# Altium schematic sheet Enregistreur et Speaker Audio.SchDoc
size Letter; Organization: Cegep Limoilou; Address1: 1300, 8e Avenue; Address2: Québec, QC; Address3: Canada; Address4: G1J 5L5; Revision: Enseignants; SheetNumber: 4; SheetTotal: 9; Conception: Ilyes Gharmoul; Titre: Enregistreur et Speaker; Modification: Ilyes G
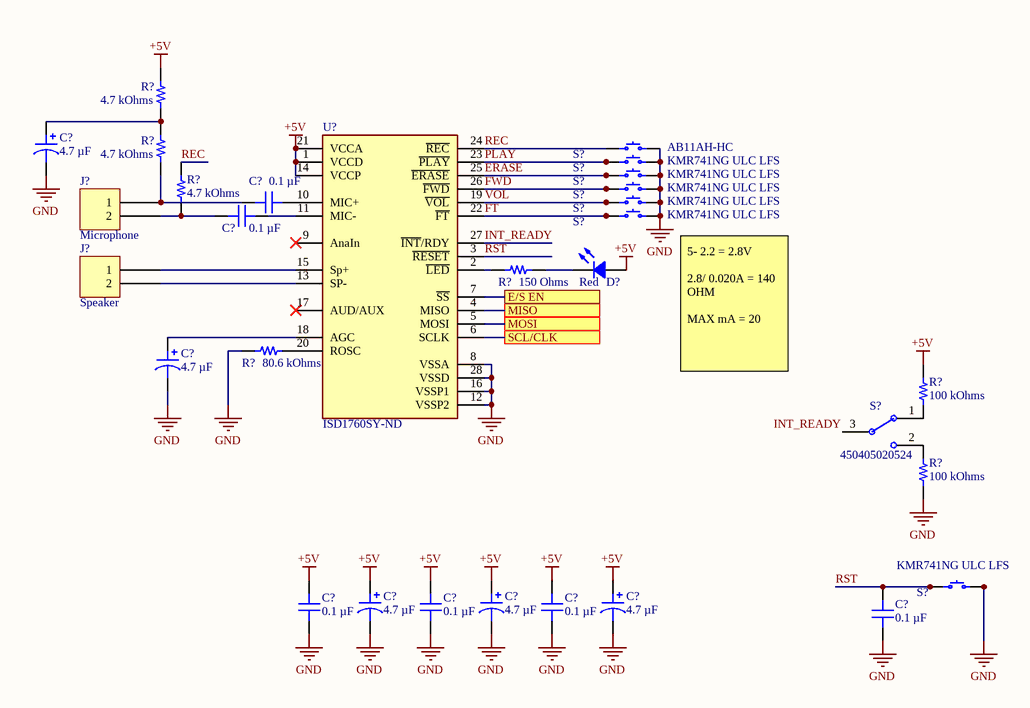
[diagram p0: Enregistreur et Speaker Audio.SchDoc]

## Parts
(Parts that share a designator on the sheet are numbered #1, #2 ... from top to bottom, then left to right.)
C?#1  4.7 µF  [CAP ALSMD 4.3MM H5.4MM]
C?#2  0.1 µF  [CAP 0603_1608]
C?#3  0.1 µF  [CAP 0603_1608]
C?#4  4.7 µF  [CAP ALSMD 4.3MM H5.4MM]
C?#5  0.1 µF  [CAP 0603_1608]
C?#6  4.7 µF  [CAP ALSMD 4.3MM H5.4MM]
C?#7  0.1 µF  [CAP 0603_1608]
C?#8  4.7 µF  [CAP ALSMD 4.3MM H5.4MM]
C?#9  0.1 µF  [CAP 0603_1608]
C?#10  4.7 µF  [CAP ALSMD 4.3MM H5.4MM]
C?#11  0.1 µF  [CAP 0603_1608]
D?  Red  [LED 0603_1608 RED]
J?#1  Microphone  [TE 282834-2]
J?#2  Speaker  [TE 282834-2]
R?#1  4.7 kOhms  [RES 0603_1608]
R?#2  4.7 kOhms  [RES 0603_1608]
R?#3  4.7 kOhms  [RES 0603_1608]
R?#4  150 Ohms  [RES 0603_1608]
R?#5  80.6 kOhms  [RES 0603_1608]
R?#6  100 kOhms  [RES 0603_1608]
R?#7  100 kOhms  [RES 0603_1608]
S?#1  AB11AH-HC  [NKK AB11AH-HC]
S?#2  KMR741NG ULC LFS  [C&K KMR7]
S?#3  KMR741NG ULC LFS  [C&K KMR7]
S?#4  KMR741NG ULC LFS  [C&K KMR7]
S?#5  KMR741NG ULC LFS  [C&K KMR7]
S?#6  KMR741NG ULC LFS  [C&K KMR7]
S?#7  450405020524  [WURTH WS-SLSU 450405020524]
S?#8  KMR741NG ULC LFS  [C&K KMR7]
U?  Supplier Part Number 1: ISD1760SY-ND  [ISD1760SY]  (hidden comment: ISD1760SY)

## Ports
E/S EN, MISO, MOSI, SCL/CLK

## Nets
+5V: C?#5.2 C?#6.1 C?#7.2 C?#8.1 C?#9.2 C?#10.1 D?.1 R?#1.2 R?#6.2 U?.1(VCCD) U?.14(VCCP) U?.21(VCCA)
GND: C?#1.2 C?#4.2 C?#5.1 C?#6.2 C?#7.1 C?#8.2 C?#9.1 C?#10.2 C?#11.1 R?#5.1 R?#7.1 S?#1.2 S?#2.3 S?#2.4 S?#3.3 S?#3.4 S?#4.3 S?#4.4 S?#5.3 S?#5.4 S?#6.3 S?#6.4 S?#8.3 S?#8.4 U?.8(VSSA) U?.12(VSSP2) U?.16(VSSP1) U?.28(VSSD)
E/S EN: U?.7(~{SS}) ; port E/S EN
ERASE: S?#3.1 S?#3.2 U?.25(~{ERASE})
FT: S?#6.1 S?#6.2 U?.22(~{FT})
FWD: S?#4.1 S?#4.2 U?.26(~{FWD})
INT_READY: S?#7.3(COM) U?.27(~{INT}/RDY)
MISO: U?.4(MISO) ; port MISO
MOSI: U?.5(MOSI) ; port MOSI
PLAY: S?#2.1 S?#2.2 U?.23(~{PLAY})
REC: R?#3.2 S?#1.1 U?.24(~{REC})
RST: C?#11.2 S?#8.1 S?#8.2 U?.3(~{RESET})
SCL/CLK: U?.6(SCLK) ; port SCL/CLK
VOL: S?#5.1 S?#5.2 U?.19(~{VOL})
NetC?#1_1: C?#1.1 R?#1.1 R?#2.2
NetC?#2_1: C?#2.1 U?.10(MIC+)
NetC?#2_2: C?#2.2 J?#1.1 R?#2.1
NetC?#3_1: C?#3.1 U?.11(MIC-)
NetC?#3_2: C?#3.2 J?#1.2 R?#3.1
NetC?#4_1: C?#4.1 U?.18(AGC)
NetD?_2: D?.2 R?#4.2
NetJ?#2_1: J?#2.1 U?.15(Sp+)
NetJ?#2_2: J?#2.2 U?.13(SP-)
NetR?#4_1: R?#4.1 U?.2(~{LED})
NetR?#5_2: R?#5.2 U?.20(ROSC)
NetR?#6_1: R?#6.1 S?#7.1
NetR?#7_2: R?#7.2 S?#7.2

Not connected (* = marked no-connect by the designer): U? 9(AnaIn)* 17(AUD/AUX)*

## Notes on the sheet
- (near S?#6) 5- 2.2 = 2.8V
  2.8/ 0.020A = 140 OHM
  MAX mA = 20
- Titre :
- Conception :
- Date :
- Modification :
- Heure :
- Révision :
- Feuille
- de
- Fichier :

## Library data of the parts
C?#1 C?#4 C?#6 C?#8 C?#10 = EMVE350ADA4R7MD55G: CAP ALUM 4.7UF 20% 35V SMD; manufacturer: United Chemi-Con; Lifetime @ Temp.: 1000 Hrs @ 105°C; Polarization: Polar; Ripple Current @ Low Frequency: 16 mA @ 120 Hz; Surface Mount Land Size: 0.169" L x 0.169" W (4.30mm x 4.30mm); Part Number: EMVE350ADA4R7MD55G; Applications: General Purpose; Capacitance: 4.7 µF; componentlink1description: Datasheet; componentlink1url: //media.digikey.com/pdf/Data%20Sheets/United%20Chemi-Con%20PDFs/MVE%20Series.pdf; componentlink2description: DigiKey Link; componentlink2url: https://www.digikey.com/en/products/detail/united-chemi-con/EMVE350ADA4R7MD55G/756875; Device Package: Radial, Can - SMD; Height - Seated (Max): 0.205" (5.20mm); lastupdated: 2023-04-04 19:53:03; Lifecycle Status: Active; Minimum Order: 1; Mounting Type: Surface Mount; Operating Temperature: -40°C ~ 105°C; Package / Case: Radial, Can - SMD; packaging: TapeAndReel; partid: 7039; Part Status: Active; price: 0.06; series: Alchip™- MVE; Size / Dimension: 0.157" Dia (4.00mm); Supplier 1: DigiKey; Supplier Part Number 1: 565-2229-1-ND; Tolerance: ±20%; value: 4.7 µF; Voltage - Rated: 35 V
C?#2 C?#3 C?#5 C?#7 C?#9 C?#11 = CS0603KRX7R7BB104: CAP CER 0.1UF 16V X7R 0603; manufacturer: Yageo; Tolerance: ±10%; Part Number: CS0603KRX7R7BB104; Value: 0.1 µF; Applications: Boardflex Sensitive; Capacitance: 0.1 µF; componentlink1description: Datasheet; componentlink1url: http://www.yageo.com/NewPortal/yageodocoutput?fileName=/pdf/MLCC/UPY-ST_NPOX7R_16V-to-3KV_5.pdf; componentlink2description: DigiKey Link; componentlink2url: https://www.digikey.com/en/products/detail/yageo/CS0603KRX7R7BB104/6097897; Device Package: 0603 (1608 Metric); Features: Soft Termination; lastupdated: 2023-04-02 19:09:22; Lifecycle Status: Active; Minimum Order: 1; Mounting Type: Surface Mount, MLCC; Operating Temperature: -55°C ~ 125°C; Package / Case: 0603 (1608 Metric); packaging: TapeAndReel; partid: 2286; Part Status: Active; price: 0.01; series: CS; Size / Dimension: 0.063" L x 0.031" W (1.60mm x 0.80mm); Supplier 1: DigiKey; Supplier Part Number 1: 311-3560-1-ND; Temperature Coefficient: X7R; Thickness (Max): 0.037" (0.95mm); Voltage - Rated: 16V
D? = BL-HUB36A-AV-TRB: 0603 RED; Manufacturer: American Bright Optoelectronics Corporation; Configuration: Standard; Current - Test: 20mA; Lens Color: Colorless; Lens Style: Rectangle with Flat Top; Lens Transparency: Clear; Millicandela Rating: 94mcd; Viewing Angle: 120°; Voltage - Forward (Vf) (Typ): 2.2V; Wavelength - Dominant: 632nm; Wavelength - Peak: 645nm; Part Number: BL-HUB36A-AV-TRB; Color: Red; ComponentLink1Description: Datasheet; ComponentLink1URL: https://americanbrightled.com/pdffiles/smt/BL-HUB36A-AV-TRB.pdf; ComponentLink2Description: DigiKey Link; ComponentLink2URL: https://www.digikey.com/en/products/detail/american-bright-optoelectronics-corporation/BL-HUB36A-AV-TRB/9678174; Device Package: 0603 (1608 Metric); Height (Max): 0.70mm; LastUpdated: 2023-03-27 19:53:19; Lifecycle Status: Active; Minimum Order: 1; Mounting Type: Surface Mount; Package / Case: 0603 (1608 Metric); Packaging: TapeAndReel; PartId: 1020; Part Status: Active; Price: 0.04; Series: -; Size / Dimension: 1.60mm L x 0.80mm W; Supplier 1: DigiKey; Supplier Part Number 1: BL-HUB36A-AV-TRBCT-ND; Supplier Device Package: 0603; Value: Red
J?#1 J?#2 = 282834-2: TERM BLK 2P SIDE ENT 2.54MM PCB; Manufacturer: TE Connectivity AMP Connectors; Current: 10A; Mating Orientation: Horizontal with Board; Number of Levels: 1; Pitch: 0.100" (2.54mm); Positions Per Level: 2; Voltage: 150V; Wire Gauge: 16-30 AWG; Wire Termination: Screw - Rising Cage Clamp; Part Number: 282834-2; Color: Green; ComponentLink1Description: Datasheet; ComponentLink1URL: https://www.te.com/commerce/DocumentDelivery/DDEController?Action=srchrtrv&DocNm=282834&DocType=Customer+Drawing&DocLang=English; ComponentLink2Description: DigiKey Link; ComponentLink2URL: http://digikey.com/product-detail/en/te-connectivity-amp-connectors/282834-2/A98333-ND/1150135; LastUpdated: 2020-01-15 04:15:38; Lifecycle Status: Active; Minimum Order: 1; Mounting Type: Through Hole; Packaging: Bulk; Part Status: Active; Price: 0.88; Series: Buchanan; Supplier 1: DigiKey; Supplier Part Number 1: A98333-ND
R?#1-R?#3 = RMCF0603FT4K70: RES 4.7K OHM 1% 1/10W 0603; Manufacturer: Stackpole Electronics Inc; Power (Watts): 0.1W, 1/10W; Temperature Coefficient: ±100ppm/°C; Part Number: RMCF0603FT4K70; Value: 4.7 kOhms; ComponentLink1Description: Datasheet; ComponentLink1URL: https://www.seielect.com/catalog/sei-rmcf_rmcp.pdf; ComponentLink2Description: DigiKey Link; ComponentLink2URL: https://www.digikey.com/en/products/detail/stackpole-electronics-inc/RMCF0603FT4K70/1760998; Composition: Thick Film; Device Package: 0603 (1608 Metric); Features: Automotive AEC-Q200; Height - Seated (Max): 0.022" (0.55mm); LastUpdated: 2023-04-04 19:29:43; Lifecycle Status: Active; Minimum Order: 1; Number of Terminations: 2; Operating Temperature: -55°C ~ 155°C; Package / Case: 0603 (1608 Metric); Packaging: CutTape; PartId: 6078; Part Status: Active; Price: 0.01; Ratings: AEC-Q200; Resistance: 4.7 kOhms; Series: RMCF; Size / Dimension: 0.061" L x 0.031" W (1.55mm x 0.80mm); Supplier 1: DigiKey; Supplier Part Number 1: RMCF0603FT4K70CT-ND; Supplier Device Package: 0603; Tolerance: ±1%
R?#4 = MCT0603MD1500BP100: RES SMD 150 OHM 0.1% 1/8W 0603; Manufacturer: Vishay Beyschlag; Power (Watts): 0.125W, 1/8W; Temperature Coefficient: ±25ppm/°C; Part Number: MCT0603MD1500BP100; Value: 150 Ohms; ComponentLink1Description: Datasheet; ComponentLink1URL: http://www.vishay.com/docs/28785/mcat_pre.pdf; ComponentLink2Description: DigiKey Link; ComponentLink2URL: http://digikey.com/product-detail/en/vishay-beyschlag/MCT0603MD1500BP100/MCT0603-150-MBCT-ND/2092134; Composition: Thin Film; Device Package: 0603 (1608 Metric); Features: Anti-Sulfur, Automotive AEC-Q200; Height - Seated (Max): 0.022" (0.55mm); LastUpdated: 2023-04-04 19:29:46; Lifecycle Status: Active; Minimum Order: 1; Number of Terminations: 2; Operating Temperature: -55°C ~ 155°C; Package / Case: 0603 (1608 Metric); Packaging: TapeAndReel; PartId: 5246; Part Status: Active; Price: 0.23; Ratings: AEC-Q200; Resistance: 150 Ohms; Series: MCT AT - Precision; Size / Dimension: 0.061" L x 0.033" W (1.55mm x 0.85mm); Supplier 1: DigiKey; Supplier Part Number 1: MCT0603-150-MBCT-ND; Supplier Device Package: 0603; Tolerance: ±0.1%
R?#5 = RCS060380K6FKEA: RES SMD 80.6K OHM 1% 1/4W 0603; Manufacturer: Vishay Dale; Power (Watts): 0.25W, 1/4W; Temperature Coefficient: ±100ppm/°C; Part Number: RCS060380K6FKEA; Value: 80.6 kOhms; ComponentLink1Description: Datasheet; ComponentLink1URL: https://www.vishay.com/docs/20065/rcse3.pdf; ComponentLink2Description: DigiKey Link; ComponentLink2URL: https://www.digikey.com/en/products/detail/vishay-dale/RCS060380K6FKEA/5868691; Composition: Thick Film; Device Package: 0603 (1608 Metric); Features: Automotive AEC-Q200, Pulse Withstanding; Height - Seated (Max): 0.020" (0.50mm); LastUpdated: 2023-04-04 19:27:58; Lifecycle Status: Active; Minimum Order: 1; Number of Terminations: 2; Operating Temperature: -55°C ~ 155°C; Package / Case: 0603 (1608 Metric); Packaging: TapeAndReel; PartId: 62631; Part Status: Active; Price: 0.02; Ratings: AEC-Q200; Resistance: 80.6 kOhms; Series: RCS e3; Size / Dimension: 0.061" L x 0.033" W (1.55mm x 0.85mm); Supplier 1: DigiKey; Supplier Part Number 1: 541-RCS060380K6FKEACT-ND; Supplier Device Package: 0603; Tolerance: ±1%
R?#6 R?#7 = CMP0603AFX-1003ELF: RESHIGHPOWERA 0603 100K 1% 1/4W; Manufacturer: Bourns Inc.; Power (Watts): 0.25W, 1/4W; Temperature Coefficient: ±100ppm/°C; Part Number: CMP0603AFX-1003ELF; Value: 100 kOhms; ComponentLink1Description: Datasheet; ComponentLink1URL: https://www.bourns.com/docs/Product-Datasheets/CMP-A.pdf; ComponentLink2Description: DigiKey Link; ComponentLink2URL: https://www.digikey.com/en/products/detail/bourns-inc/CMP0603AFX-1003ELF/12333642; Composition: Thick Film; Device Package: 0603 (1608 Metric); Features: Anti-Sulfur, Automotive AEC-Q200, Moisture Resistant, Pulse Withstanding; Height - Seated (Max): 0.022" (0.55mm); LastUpdated: 2023-04-04 19:28:10; Lifecycle Status: Active; Minimum Order: 1; Number of Terminations: 2; Operating Temperature: -55°C ~ 155°C; Package / Case: 0603 (1608 Metric); Packaging: TapeAndReel; PartId: 64150; Part Status: Active; Price: 0.03; Ratings: AEC-Q200; Resistance: 100 kOhms; Series: CMP-A; Size / Dimension: 0.063" L x 0.031" W (1.60mm x 0.80mm); Supplier 1: DigiKey; Supplier Part Number 1: 118-CMP0603AFX-1003ELFCT-ND; Supplier Device Package: 0603; Tolerance: ±1%
S?#1 = AB11AH-HC: SWITCH PUSH SPST-NO 0.4VA 28V; Manufacturer: NKK Switches; Actuator Type: Round, Button; Color - Actuator/Cap: Red; Current Rating (Amps): 0.4VA (AC/DC); Switch Function: Off-Mom; Part Number: AB11AH-HC; Circuit: SPST-NO; ComponentLink1Description: Datasheet; ComponentLink1URL: https://www.nkkswitches.com/pdf/Apushbuttons.pdf; ComponentLink2Description: DigiKey Link; ComponentLink2URL: http://digikey.com/product-detail/en/nkk-switches/AB11AH-HC/360-2604-ND/1056046; Features: Sealed - Fully; LastUpdated: 2020-01-25 20:05:42; Lifecycle Status: Active; Minimum Order: 1; Mounting Type: Through Hole, Right Angle; Operating Temperature: -30°C ~ 85°C; Packaging: Tray; Part Status: Active; Price: 5.00; Series: AB; Supplier 1: DigiKey; Supplier Part Number 1: 360-2604-ND; Termination Style: PC Pin; Type: Standard; Voltage Rating - AC: 28V; Voltage Rating - DC: 28V
S?#2-S?#6 S?#8 = KMR741NG ULC LFS: SWITCH TACTILE SPST-NO 50MA 32V; Manufacturer: C&K; Actuator Height off PCB, Vertical: 2.50mm; Actuator Orientation: Top Actuated; Actuator Type: Standard; Contact Rating @ Voltage: 0.05A @ 32VDC; Illumination: Non-Illuminated; Ingress Protection: IP67 - Dust Tight, Waterproof; Operating Force: 400gf; Outline: 4.20mm x 2.80mm; Switch Function: Off-Mom; Part Number: KMR741NG ULC LFS; Circuit: SPST-NO; ComponentLink1Description: Datasheet; ComponentLink1URL: https://dznh3ojzb2azq.cloudfront.net/products/Tactile/KMR7/documents/datasheet.pdf; ComponentLink2Description: DigiKey Link; ComponentLink2URL: http://digikey.com/product-detail/en/c-k/KMR741NG-ULC-LFS/CKN10688CT-ND/6035360; LastUpdated: 2020-04-09 10:01:05; Lifecycle Status: Active; Minimum Order: 1; Mounting Type: Surface Mount; Operating Temperature: -40°C ~ 85°C; Packaging: TapeAndReel; Part Status: Active; Price: 0.16; Series: KMR7; Supplier 1: DigiKey; Supplier Part Number 1: CKN10688CT-ND; Termination Style: Gull Wing
S?#7 = 450405020524: SMT 8.7 X 3.0 MM MINI SLIDE SWIT; Manufacturer: Würth Elektronik; Rated Current: 300mA; Rated Voltage: 5VDC; Switching Function: On-On; Circuit: SPDT; Actuator Length: 2.00mm; Actuator Type: Standard; Contact Timing: Non-Shorting (BBM); Current Rating (Amps): 300mA (DC); Voltage Rating - DC: 5 V; ComponentLink1Description: Datasheet; ComponentLink1URL: https://www.we-online.com/catalog/datasheet/450405020524.pdf; ComponentLink2Description: DigiKey Link; ComponentLink2URL: https://www.digikey.com/en/products/detail/würth-elektronik/450405020524/11627297; Packaging: TapeAndReel; Publisher: Wurth Elektronik; Contact Material: Copper Alloy; Mounting Technology: SMT; Operating Temperature: -40°C ~ 85°C; Contact Plating: Silver; Part Number: 450405020524; Published Date: November 2019; Terminal Material: Copper Alloy; Size: 8.7x3mm; Terminal Plating: Silver; Contact Finish: Silver; LastUpdated: 2022-06-20 13:21:27; Lifecycle Status: Active; Minimum Order: 1; Mounting Type: Surface Mount; PartId: 4; Part Status: Active; Price: 0.73; Series: WS-SLSU; Supplier 1: DigiKey; Supplier Part Number 1: 732-450405020524CT-ND; Switch Function: On-On; Termination Style: SMD (SMT) Tab
U? = ISD1760SY: Voice Record/Playback IC Multiple Message 40 ~ 120 Sec Pushbutton, SPI 28-SOIC; Manufacturer Part Number: ISD1760SY; Supplier 1: Digi-Key